# Altium schematic sheet Reefing-MCU.SchDoc: Reefing System
size A4; DocumentNumber: Subtitle; Revision: V1.0; SheetNumber: 2; SheetTotal: 13; Author: Luca Jost; Subtitle: Microcontroller
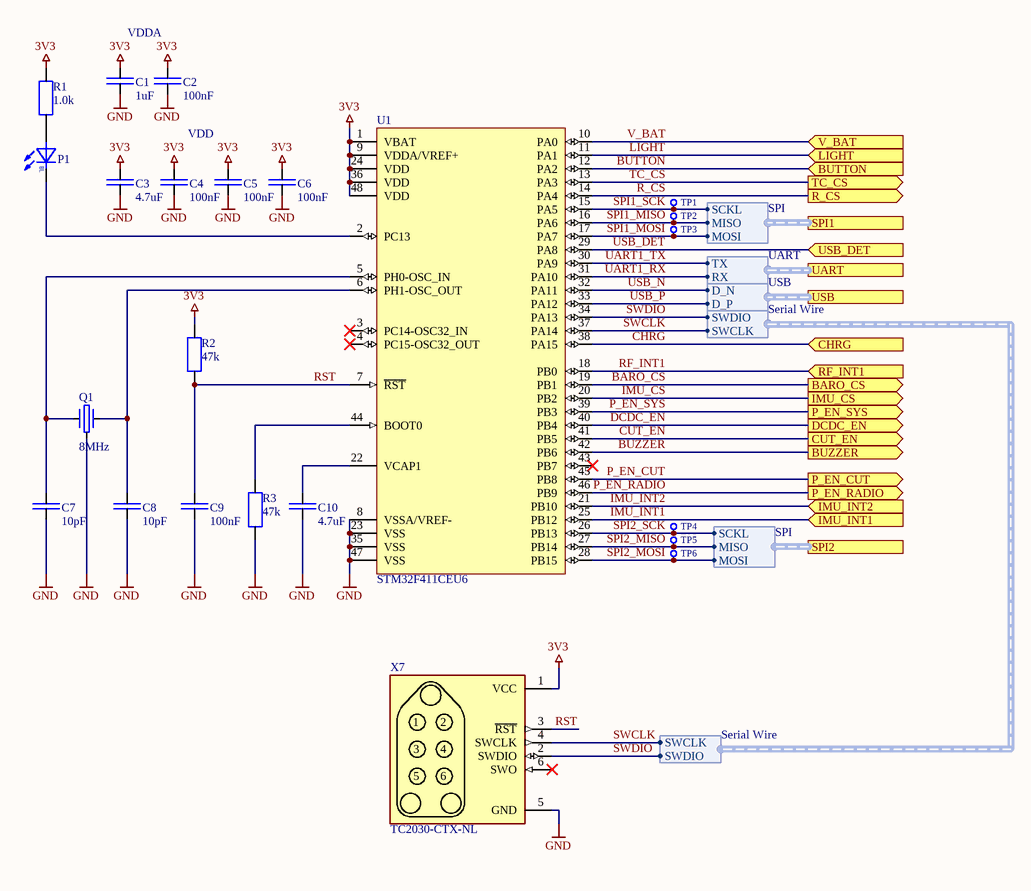
[diagram p0: Reefing-MCU.SchDoc]

## Parts
C1  1uF  [SMD Keramikkondensator 0402]
C2  100nF  [SMD Keramikkondensator 0402]
C3  4.7uF  [SMD Keramikkondensator 0402]
C4  100nF  [SMD Keramikkondensator 0402]
C5  100nF  [SMD Keramikkondensator 0402]
C6  100nF  [SMD Keramikkondensator 0402]
C7  10pF  [SMD Keramikkondensator 0402]
C8  10pF  [SMD Keramikkondensator 0402]
C9  100nF  [SMD Keramikkondensator 0402]
C10  4.7uF  [SMD Keramikkondensator 0402]
P1  LED  [SMD LED 0603]  (value not drawn)
Q1  8MHz  [SMD Crystal 3.2X2.5X0.8]
R1  1.0k  [SMD Widerstand 0402]
R2  47k  [SMD Widerstand 0402]
R3  47k  [SMD Widerstand 0402]
TP1  X-TP  [SMD Testpoint 1mm]  (value not drawn)  (no BOM)
TP2  X-TP  [SMD Testpoint 1mm]  (value not drawn)  (no BOM)
TP3  X-TP  [SMD Testpoint 1mm]  (value not drawn)  (no BOM)
TP4  X-TP  [SMD Testpoint 1mm]  (value not drawn)  (no BOM)
TP5  X-TP  [SMD Testpoint 1mm]  (value not drawn)  (no BOM)
TP6  X-TP  [SMD Testpoint 1mm]  (value not drawn)  (no BOM)
U1  STM32F411CEU6  [SMD IC QFN-48]
X7  TC2030-CTX-NL  [SMD Connector TC2030]  (no BOM)

## Ports
BARO_CS (out), BUTTON (in), BUZZER (out), CHRG (in), CUT_EN (out), DCDC_EN (out), IMU_CS (out), IMU_INT1 (in), IMU_INT2 (in), LIGHT (in), P_EN_CUT (out), P_EN_RADIO (out), P_EN_SYS (out), R_CS (out), RF_INT1 (in), SPI1 (harness SPI), SPI2 (harness SPI), TC_CS (out), UART (harness UART), USB (harness USB), USB_DET (in), V_BAT (in)

## Harnesses
SPI: MOSI, MISO, SCKL
UART: TX, RX
USB: D_P, D_N
Serial Wire: SWCLK, SWDIO
Serial Wire: SWDIO, SWCLK

## Nets
3V3: C1.2 C2.2 C3.2 C4.2 C5.2 C6.2 R1.2 R2.2 U1.1(VBAT) U1.9(VDDA/VREF+) U1.24(VDD) U1.36(VDD) U1.48(VDD) X7.1(VCC)
GND: C1.1 C2.1 C3.1 C4.1 C5.1 C6.1 C7.1 C8.1 C9.1 C10.1 Q1.3 R3.1 U1.8(VSSA/VREF-) U1.23(VSS) U1.35(VSS) U1.47(VSS) X7.5(GND)
BARO_CS: U1.19(PB1) ; port BARO_CS
BUTTON: U1.12(PA2) ; port BUTTON
BUZZER: U1.42(PB6) ; port BUZZER
CHRG: U1.38(PA15) ; port CHRG
CUT_EN: U1.41(PB5) ; port CUT_EN
DCDC_EN: U1.40(PB4) ; port DCDC_EN
IMU_CS: U1.20(PB2) ; port IMU_CS
IMU_INT1: U1.25(PB12) ; port IMU_INT1
IMU_INT2: U1.21(PB10) ; port IMU_INT2
LIGHT: U1.11(PA1) ; port LIGHT
P_EN_CUT: U1.45(PB8) ; port P_EN_CUT
P_EN_RADIO: U1.46(PB9) ; port P_EN_RADIO
P_EN_SYS: U1.39(PB3) ; port P_EN_SYS
R_CS: U1.14(PA4) ; port R_CS
RF_INT1: U1.18(PB0) ; port RF_INT1
RST: C9.2 R2.1 U1.7(~{RST}) X7.3(~{RST})
SPI1_MISO: TP2.1 U1.16(PA6) ; port SPI1.MISO
SPI1_MOSI: TP3.1 U1.17(PA7) ; port SPI1.MOSI
SPI1_SCK: TP1.1 U1.15(PA5) ; port SPI1.SCKL
SPI2_MISO: TP5.1 U1.27(PB14) ; port SPI2.MISO
SPI2_MOSI: TP6.1 U1.28(PB15) ; port SPI2.MOSI
SPI2_SCK: TP4.1 U1.26(PB13) ; port SPI2.SCKL
SWCLK: U1.37(PA14) X7.4(SWCLK) ; harness Serial Wire.SWCLK
SWDIO: U1.34(PA13) X7.2(SWDIO) ; harness Serial Wire.SWDIO
TC_CS: U1.13(PA3) ; port TC_CS
UART1_RX: U1.31(PA10) ; port UART.RX
UART1_TX: U1.30(PA9) ; port UART.TX
USB_DET: U1.29(PA8) ; port USB_DET
USB_N: U1.32(PA11) ; port USB.D_N
USB_P: U1.33(PA12) ; port USB.D_P
V_BAT: U1.10(PA0) ; port V_BAT
NetC7_2: C7.2 Q1.1 U1.5(PH0-OSC_IN)
NetC8_2: C8.2 Q1.2 U1.6(PH1-OSC_OUT)
NetC10_2: C10.2 U1.22(VCAP1)
NetP1_A: P1.A R1.1
NetP1_K: P1.K U1.2(PC13)
NetR3_2: R3.2 U1.44(BOOT0)

Not connected (* = marked no-connect by the designer): U1 3(PC14-OSC32_IN)* 4(PC15-OSC32_OUT)* 43(PB7)*; X7 6(SWO)*

## Notes on the sheet
- VDDA
- VDD
- Title
- Author:
- Subtitle
- Date:
- Rev:
- File:
- Sheet
- of
- (in symbol LED) BL

## Library data of the parts
C1 = E6 - 1uF: SMD Ceramic Capacitor E6; Unit Price: 0.01; JLC: C52923
C2 C4-C6 C9 = E6 - 100nF: SMD Ceramic Capacitor E6; Unit Price: 0.01; JLC: C307331
C3 C10 = E6 - 4.7uF: SMD Ceramic Capacitor E6; Unit Price: 0.01; JLC: C23733
C7 C8 = E6 - 10pF: SMD Ceramic Capacitor E6; Unit Price: 0.01; JLC: C32949
P1 = LED: Color LED; JLC: C72041
Q1 = Crystal: SMD Crystal Resonators 8MHz ±10ppm SMD,3.2x2.5mm; Digikey: 535-15255-1-ND; JLC: C2682775; Unit Price: 0.24
R1 = E24 - 1.0k: SMD Chip Resistor E24; Unit Price: 0.01; JLC: C11702
R2 R3 = E24 - 47k: SMD Chip Resistor E24; Unit Price: 0.01; JLC: C25792
TP1-TP6 = X-TP: Testpunkt; Unit Price: 0.00
U1 = STM32F411CEU6: ARM® Cortex®-M4 series Microcontroller IC 32-Bit 100MHz 512KB (512K x 8) FLASH 48-UFQFPN (7x7); Digikey: 497-14907-ND; JLC: C60420; ComponentLink1Description: Datasheet; ComponentLink1URL: https://datasheet.lcsc.com/lcsc/1809291612_STMicroelectronics-STM32F411CEU6_C60420.pdf; Unit Price: 7.10
X7 = TC2030-CTX-NL: Tag-Connect for ARM-Cortex (6-Pin); Unit Price: 0.00